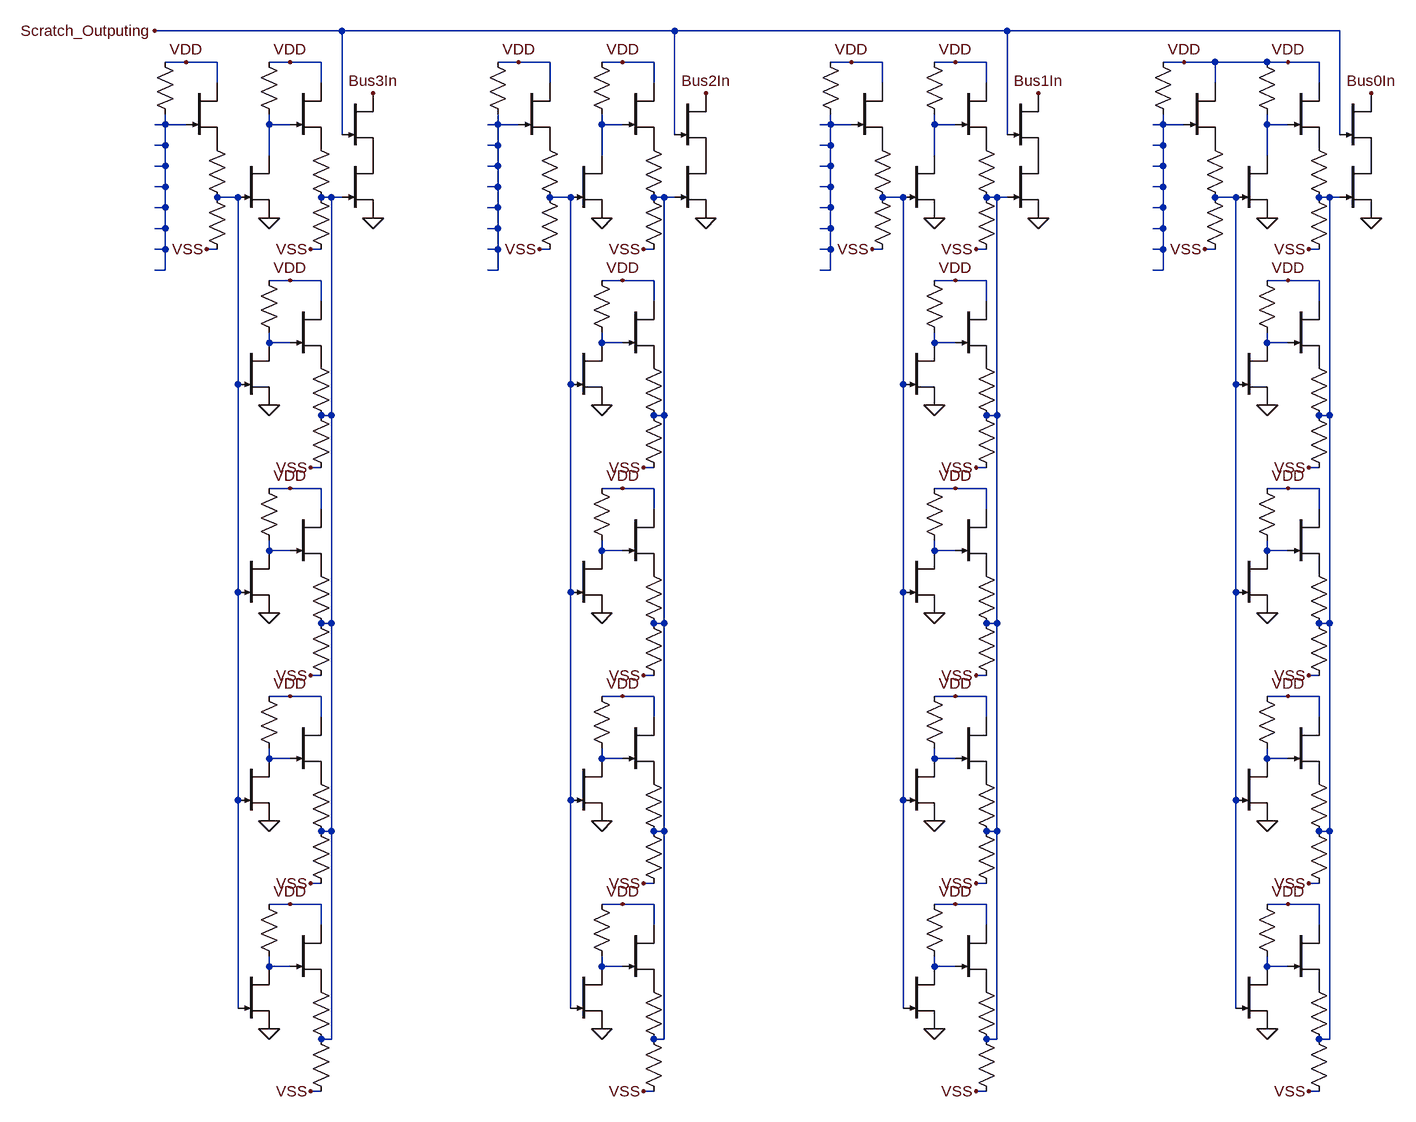
[diagram p0: schematic Bus2.asc]
Bus2.asc, the LTspice schematic file:
Version 4.1
SHEET 1 109444 42780
WIRE 40544 2832 40256 2832
WIRE 41056 2832 40544 2832
WIRE 41568 2832 41056 2832
WIRE 42080 2832 41568 2832
WIRE 40304 2880 40272 2880
WIRE 40352 2880 40304 2880
WIRE 40464 2880 40432 2880
WIRE 40512 2880 40464 2880
WIRE 40816 2880 40784 2880
WIRE 40864 2880 40816 2880
WIRE 40976 2880 40944 2880
WIRE 41024 2880 40976 2880
WIRE 41328 2880 41296 2880
WIRE 41376 2880 41328 2880
WIRE 41488 2880 41456 2880
WIRE 41536 2880 41488 2880
WIRE 41840 2880 41808 2880
WIRE 41888 2880 41840 2880
WIRE 41968 2880 41888 2880
WIRE 42000 2880 41968 2880
WIRE 42048 2880 42000 2880
WIRE 40352 2912 40352 2880
WIRE 40512 2912 40512 2880
WIRE 40864 2912 40864 2880
WIRE 41024 2912 41024 2880
WIRE 41376 2912 41376 2880
WIRE 41536 2912 41536 2880
WIRE 41888 2912 41888 2880
WIRE 42048 2912 42048 2880
WIRE 40272 2976 40272 2960
WIRE 40272 2976 40256 2976
WIRE 40304 2976 40272 2976
WIRE 40432 2976 40432 2960
WIRE 40464 2976 40432 2976
WIRE 40784 2976 40784 2960
WIRE 40784 2976 40768 2976
WIRE 40816 2976 40784 2976
WIRE 40944 2976 40944 2960
WIRE 40976 2976 40944 2976
WIRE 41296 2976 41296 2960
WIRE 41296 2976 41280 2976
WIRE 41328 2976 41296 2976
WIRE 41456 2976 41456 2960
WIRE 41488 2976 41456 2976
WIRE 41808 2976 41808 2960
WIRE 41808 2976 41792 2976
WIRE 41840 2976 41808 2976
WIRE 41968 2976 41968 2960
WIRE 42000 2976 41968 2976
WIRE 40544 2992 40544 2832
WIRE 41056 2992 41056 2832
WIRE 41568 2992 41568 2832
WIRE 42080 2992 42080 2832
WIRE 40272 3008 40272 2976
WIRE 40272 3008 40256 3008
WIRE 40784 3008 40784 2976
WIRE 40784 3008 40768 3008
WIRE 41296 3008 41296 2976
WIRE 41296 3008 41280 3008
WIRE 41808 3008 41808 2976
WIRE 41808 3008 41792 3008
WIRE 40432 3024 40432 2976
WIRE 40944 3024 40944 2976
WIRE 41456 3024 41456 2976
WIRE 41968 3024 41968 2976
WIRE 40272 3040 40272 3008
WIRE 40272 3040 40256 3040
WIRE 40784 3040 40784 3008
WIRE 40784 3040 40768 3040
WIRE 41296 3040 41296 3008
WIRE 41296 3040 41280 3040
WIRE 41808 3040 41808 3008
WIRE 41808 3040 41792 3040
WIRE 40272 3072 40272 3040
WIRE 40272 3072 40256 3072
WIRE 40784 3072 40784 3040
WIRE 40784 3072 40768 3072
WIRE 41296 3072 41296 3040
WIRE 41296 3072 41280 3072
WIRE 41808 3072 41808 3040
WIRE 41808 3072 41792 3072
WIRE 40384 3088 40352 3088
WIRE 40528 3088 40512 3088
WIRE 40544 3088 40528 3088
WIRE 40896 3088 40864 3088
WIRE 41040 3088 41024 3088
WIRE 41056 3088 41040 3088
WIRE 41408 3088 41376 3088
WIRE 41552 3088 41536 3088
WIRE 41568 3088 41552 3088
WIRE 41920 3088 41888 3088
WIRE 42064 3088 42048 3088
WIRE 42080 3088 42064 3088
WIRE 40272 3104 40272 3072
WIRE 40272 3104 40256 3104
WIRE 40784 3104 40784 3072
WIRE 40784 3104 40768 3104
WIRE 41296 3104 41296 3072
WIRE 41296 3104 41280 3104
WIRE 41808 3104 41808 3072
WIRE 41808 3104 41792 3104
WIRE 40272 3136 40272 3104
WIRE 40272 3136 40256 3136
WIRE 40784 3136 40784 3104
WIRE 40784 3136 40768 3136
WIRE 41296 3136 41296 3104
WIRE 41296 3136 41280 3136
WIRE 41808 3136 41808 3104
WIRE 41808 3136 41792 3136
WIRE 40272 3168 40272 3136
WIRE 40272 3168 40256 3168
WIRE 40352 3168 40336 3168
WIRE 40512 3168 40496 3168
WIRE 40784 3168 40784 3136
WIRE 40784 3168 40768 3168
WIRE 40864 3168 40848 3168
WIRE 41024 3168 41008 3168
WIRE 41296 3168 41296 3136
WIRE 41296 3168 41280 3168
WIRE 41376 3168 41360 3168
WIRE 41536 3168 41520 3168
WIRE 41808 3168 41808 3136
WIRE 41808 3168 41792 3168
WIRE 41888 3168 41872 3168
WIRE 42048 3168 42032 3168
WIRE 40272 3200 40272 3168
WIRE 40272 3200 40256 3200
WIRE 40784 3200 40784 3168
WIRE 40784 3200 40768 3200
WIRE 41296 3200 41296 3168
WIRE 41296 3200 41280 3200
WIRE 41808 3200 41808 3168
WIRE 41808 3200 41792 3200
WIRE 40464 3216 40432 3216
WIRE 40512 3216 40464 3216
WIRE 40976 3216 40944 3216
WIRE 41024 3216 40976 3216
WIRE 41488 3216 41456 3216
WIRE 41536 3216 41488 3216
WIRE 42000 3216 41968 3216
WIRE 42048 3216 42000 3216
WIRE 40512 3248 40512 3216
WIRE 41024 3248 41024 3216
WIRE 41536 3248 41536 3216
WIRE 42048 3248 42048 3216
WIRE 40432 3312 40432 3296
WIRE 40464 3312 40432 3312
WIRE 40944 3312 40944 3296
WIRE 40976 3312 40944 3312
WIRE 41456 3312 41456 3296
WIRE 41488 3312 41456 3312
WIRE 41968 3312 41968 3296
WIRE 42000 3312 41968 3312
WIRE 40384 3376 40384 3088
WIRE 40896 3376 40896 3088
WIRE 41408 3376 41408 3088
WIRE 41920 3376 41920 3088
WIRE 40528 3424 40528 3088
WIRE 40528 3424 40512 3424
WIRE 41040 3424 41040 3088
WIRE 41040 3424 41024 3424
WIRE 41552 3424 41552 3088
WIRE 41552 3424 41536 3424
WIRE 42064 3424 42064 3088
WIRE 42064 3424 42048 3424
WIRE 40512 3504 40496 3504
WIRE 41024 3504 41008 3504
WIRE 41536 3504 41520 3504
WIRE 42048 3504 42032 3504
WIRE 40464 3536 40432 3536
WIRE 40512 3536 40464 3536
WIRE 40976 3536 40944 3536
WIRE 41024 3536 40976 3536
WIRE 41488 3536 41456 3536
WIRE 41536 3536 41488 3536
WIRE 42000 3536 41968 3536
WIRE 42048 3536 42000 3536
WIRE 40512 3568 40512 3536
WIRE 41024 3568 41024 3536
WIRE 41536 3568 41536 3536
WIRE 42048 3568 42048 3536
WIRE 40432 3632 40432 3616
WIRE 40464 3632 40432 3632
WIRE 40944 3632 40944 3616
WIRE 40976 3632 40944 3632
WIRE 41456 3632 41456 3616
WIRE 41488 3632 41456 3632
WIRE 41968 3632 41968 3616
WIRE 42000 3632 41968 3632
WIRE 40384 3696 40384 3376
WIRE 40896 3696 40896 3376
WIRE 41408 3696 41408 3376
WIRE 41920 3696 41920 3376
WIRE 40528 3744 40528 3424
WIRE 40528 3744 40512 3744
WIRE 41040 3744 41040 3424
WIRE 41040 3744 41024 3744
WIRE 41552 3744 41552 3424
WIRE 41552 3744 41536 3744
WIRE 42064 3744 42064 3424
WIRE 42064 3744 42048 3744
WIRE 40512 3824 40496 3824
WIRE 41024 3824 41008 3824
WIRE 41536 3824 41520 3824
WIRE 42048 3824 42032 3824
WIRE 40464 3856 40432 3856
WIRE 40512 3856 40464 3856
WIRE 40976 3856 40944 3856
WIRE 41024 3856 40976 3856
WIRE 41488 3856 41456 3856
WIRE 41536 3856 41488 3856
WIRE 42000 3856 41968 3856
WIRE 42048 3856 42000 3856
WIRE 40512 3888 40512 3856
WIRE 41024 3888 41024 3856
WIRE 41536 3888 41536 3856
WIRE 42048 3888 42048 3856
WIRE 40432 3952 40432 3936
WIRE 40464 3952 40432 3952
WIRE 40944 3952 40944 3936
WIRE 40976 3952 40944 3952
WIRE 41456 3952 41456 3936
WIRE 41488 3952 41456 3952
WIRE 41968 3952 41968 3936
WIRE 42000 3952 41968 3952
WIRE 40384 4016 40384 3696
WIRE 40896 4016 40896 3696
WIRE 41408 4016 41408 3696
WIRE 41920 4016 41920 3696
WIRE 40528 4064 40528 3744
WIRE 40528 4064 40512 4064
WIRE 41040 4064 41040 3744
WIRE 41040 4064 41024 4064
WIRE 41552 4064 41552 3744
WIRE 41552 4064 41536 4064
WIRE 42064 4064 42064 3744
WIRE 42064 4064 42048 4064
WIRE 40512 4144 40496 4144
WIRE 41024 4144 41008 4144
WIRE 41536 4144 41520 4144
WIRE 42048 4144 42032 4144
WIRE 40464 4176 40432 4176
WIRE 40512 4176 40464 4176
WIRE 40976 4176 40944 4176
WIRE 41024 4176 40976 4176
WIRE 41488 4176 41456 4176
WIRE 41536 4176 41488 4176
WIRE 42000 4176 41968 4176
WIRE 42048 4176 42000 4176
WIRE 40512 4208 40512 4176
WIRE 41024 4208 41024 4176
WIRE 41536 4208 41536 4176
WIRE 42048 4208 42048 4176
WIRE 40432 4272 40432 4256
WIRE 40464 4272 40432 4272
WIRE 40944 4272 40944 4256
WIRE 40976 4272 40944 4272
WIRE 41456 4272 41456 4256
WIRE 41488 4272 41456 4272
WIRE 41968 4272 41968 4256
WIRE 42000 4272 41968 4272
WIRE 40384 4336 40384 4016
WIRE 40896 4336 40896 4016
WIRE 41408 4336 41408 4016
WIRE 41920 4336 41920 4016
WIRE 40528 4384 40528 4064
WIRE 40528 4384 40512 4384
WIRE 41040 4384 41040 4064
WIRE 41040 4384 41024 4384
WIRE 41552 4384 41552 4064
WIRE 41552 4384 41536 4384
WIRE 42064 4384 42064 4064
WIRE 42064 4384 42048 4384
WIRE 40512 4464 40496 4464
WIRE 41024 4464 41008 4464
WIRE 41536 4464 41520 4464
WIRE 42048 4464 42032 4464
FLAG 40256 2832 Scratch_Outputing
FLAG 40304 2880 VDD
FLAG 40464 2880 VDD
FLAG 40336 3168 VSS
FLAG 40496 3168 VSS
FLAG 40432 3120 0
FLAG 40592 3120 0
FLAG 40816 2880 VDD
FLAG 40976 2880 VDD
FLAG 40848 3168 VSS
FLAG 41008 3168 VSS
FLAG 40944 3120 0
FLAG 41104 3120 0
FLAG 41328 2880 VDD
FLAG 41488 2880 VDD
FLAG 41360 3168 VSS
FLAG 41520 3168 VSS
FLAG 41456 3120 0
FLAG 41616 3120 0
FLAG 41840 2880 VDD
FLAG 42000 2880 VDD
FLAG 41872 3168 VSS
FLAG 42032 3168 VSS
FLAG 41968 3120 0
FLAG 42128 3120 0
FLAG 40592 2928 Bus3In
FLAG 41104 2928 Bus2In
FLAG 41616 2928 Bus1In
FLAG 42128 2928 Bus0In
FLAG 40464 3216 VDD
FLAG 40496 3504 VSS
FLAG 40432 3408 0
FLAG 40464 3536 VDD
FLAG 40496 3824 VSS
FLAG 40432 3728 0
FLAG 40464 3856 VDD
FLAG 40496 4144 VSS
FLAG 40432 4048 0
FLAG 40464 4176 VDD
FLAG 40496 4464 VSS
FLAG 40432 4368 0
FLAG 40976 3216 VDD
FLAG 41008 3504 VSS
FLAG 40944 3408 0
FLAG 40976 3536 VDD
FLAG 41008 3824 VSS
FLAG 40944 3728 0
FLAG 40976 3856 VDD
FLAG 41008 4144 VSS
FLAG 40944 4048 0
FLAG 40976 4176 VDD
FLAG 41008 4464 VSS
FLAG 40944 4368 0
FLAG 41488 3216 VDD
FLAG 41520 3504 VSS
FLAG 41456 3408 0
FLAG 41488 3536 VDD
FLAG 41520 3824 VSS
FLAG 41456 3728 0
FLAG 41488 3856 VDD
FLAG 41520 4144 VSS
FLAG 41456 4048 0
FLAG 41488 4176 VDD
FLAG 41520 4464 VSS
FLAG 41456 4368 0
FLAG 42000 3216 VDD
FLAG 42032 3504 VSS
FLAG 41968 3408 0
FLAG 42000 3536 VDD
FLAG 42032 3824 VSS
FLAG 41968 3728 0
FLAG 42000 3856 VDD
FLAG 42032 4144 VSS
FLAG 41968 4048 0
FLAG 42000 4176 VDD
FLAG 42032 4464 VSS
FLAG 41968 4368 0
SYMBOL res 40256 2864 R0
WINDOW 0 -99 60 Invisible 2
WINDOW 3 -73 68 Invisible 2
SYMATTR InstName R0
SYMATTR Value 100k
SYMBOL njf 40304 2912 R0
WINDOW 0 -152 12 Invisible 2
WINDOW 3 -106 23 Invisible 2
SYMATTR InstName J0
SYMATTR Value DR
SYMBOL res 40336 2992 R0
WINDOW 0 -139 -67 Invisible 2
WINDOW 3 -141 -74 Invisible 2
SYMATTR InstName R1
SYMATTR Value 1k
SYMBOL res 40336 3072 R0
WINDOW 0 -145 -159 Invisible 2
WINDOW 3 -159 -144 Invisible 2
SYMATTR InstName R2
SYMATTR Value 4.8k
SYMBOL njf 40384 3024 R0
WINDOW 0 -215 -110 Invisible 2
WINDOW 3 -183 -109 Invisible 2
SYMATTR InstName J1
SYMATTR Value DR
SYMBOL res 40416 2864 R0
WINDOW 0 -241 69 Invisible 2
WINDOW 3 -237 55 Invisible 2
SYMATTR InstName R3
SYMATTR Value 50k
SYMBOL njf 40464 2912 R0
WINDOW 0 -299 7 Invisible 2
WINDOW 3 -270 17 Invisible 2
SYMATTR InstName J2
SYMATTR Value DR
SYMBOL res 40496 2992 R0
WINDOW 0 -308 -67 Invisible 2
WINDOW 3 -292 -72 Invisible 2
SYMATTR InstName R4
SYMATTR Value 1k
SYMBOL res 40528 3184 R180
WINDOW 0 312 268 Invisible 2
WINDOW 3 276 264 Invisible 2
SYMATTR InstName R5
SYMATTR Value 4.5k
SYMBOL njf 40544 3024 R0
WINDOW 0 -376 -108 Invisible 2
WINDOW 3 -338 -116 Invisible 2
SYMATTR InstName J3
SYMATTR Value DR
SYMBOL res 40768 2864 R0
WINDOW 0 -84 62 Invisible 2
WINDOW 3 -73 68 Invisible 2
SYMATTR InstName R6
SYMATTR Value 100k
SYMBOL njf 40816 2912 R0
WINDOW 0 -149 8 Invisible 2
WINDOW 3 -106 23 Invisible 2
SYMATTR InstName J4
SYMATTR Value DR
SYMBOL res 40848 2992 R0
WINDOW 0 -139 -67 Invisible 2
WINDOW 3 -141 -74 Invisible 2
SYMATTR InstName R7
SYMATTR Value 1k
SYMBOL res 40848 3072 R0
WINDOW 0 -167 -159 Invisible 2
WINDOW 3 -159 -144 Invisible 2
SYMATTR InstName R8
SYMATTR Value 4.8k
SYMBOL njf 40896 3024 R0
WINDOW 0 -215 -110 Invisible 2
WINDOW 3 -183 -109 Invisible 2
SYMATTR InstName J5
SYMATTR Value DR
SYMBOL res 40928 2864 R0
WINDOW 0 -241 69 Invisible 2
WINDOW 3 -237 55 Invisible 2
SYMATTR InstName R9
SYMATTR Value 50k
SYMBOL njf 40976 2912 R0
WINDOW 0 -320 5 Invisible 2
WINDOW 3 -270 17 Invisible 2
SYMATTR InstName J6
SYMATTR Value DR
SYMBOL res 41008 2992 R0
WINDOW 0 -296 -63 Invisible 2
WINDOW 3 -292 -72 Invisible 2
SYMATTR InstName R10
SYMATTR Value 1k
SYMBOL res 41040 3184 R180
WINDOW 0 312 268 Invisible 2
WINDOW 3 276 264 Invisible 2
SYMATTR InstName R11
SYMATTR Value 4.5k
SYMBOL njf 41056 3024 R0
WINDOW 0 -383 -108 Invisible 2
WINDOW 3 -338 -116 Invisible 2
SYMATTR InstName J7
SYMATTR Value DR
SYMBOL res 41280 2864 R0
WINDOW 0 -85 50 Invisible 2
WINDOW 3 -73 68 Invisible 2
SYMATTR InstName R12
SYMATTR Value 100k
SYMBOL njf 41328 2912 R0
WINDOW 0 -174 8 Invisible 2
WINDOW 3 -106 23 Invisible 2
SYMATTR InstName J8
SYMATTR Value DR
SYMBOL res 41360 2992 R0
WINDOW 0 -177 -72 Invisible 2
WINDOW 3 -141 -74 Invisible 2
SYMATTR InstName R13
SYMATTR Value 1k
SYMBOL res 41360 3072 R0
WINDOW 0 -154 -159 Invisible 2
WINDOW 3 -159 -144 Invisible 2
SYMATTR InstName R14
SYMATTR Value 4.8k
SYMBOL njf 41408 3024 R0
WINDOW 0 -215 -110 Invisible 2
WINDOW 3 -183 -109 Invisible 2
SYMATTR InstName J9
SYMATTR Value DR
SYMBOL res 41440 2864 R0
WINDOW 0 -241 69 Invisible 2
WINDOW 3 -237 55 Invisible 2
SYMATTR InstName R15
SYMATTR Value 50k
SYMBOL njf 41488 2912 R0
WINDOW 0 -316 6 Invisible 2
WINDOW 3 -270 17 Invisible 2
SYMATTR InstName J10
SYMATTR Value DR
SYMBOL res 41520 2992 R0
WINDOW 0 -296 -63 Invisible 2
WINDOW 3 -292 -72 Invisible 2
SYMATTR InstName R16
SYMATTR Value 1k
SYMBOL res 41552 3184 R180
WINDOW 0 312 268 Invisible 2
WINDOW 3 276 264 Invisible 2
SYMATTR InstName R17
SYMATTR Value 4.5k
SYMBOL njf 41568 3024 R0
WINDOW 0 -387 -109 Invisible 2
WINDOW 3 -338 -116 Invisible 2
SYMATTR InstName J11
SYMATTR Value DR
SYMBOL res 41792 2864 R0
WINDOW 0 -87 58 Invisible 2
WINDOW 3 -73 68 Invisible 2
SYMATTR InstName R18
SYMATTR Value 100k
SYMBOL njf 41840 2912 R0
WINDOW 0 -162 4 Invisible 2
WINDOW 3 -106 23 Invisible 2
SYMATTR InstName J12
SYMATTR Value DR
SYMBOL res 41872 2992 R0
WINDOW 0 -139 -67 Invisible 2
WINDOW 3 -141 -74 Invisible 2
SYMATTR InstName R19
SYMATTR Value 1k
SYMBOL res 41872 3072 R0
WINDOW 0 -158 -160 Invisible 2
WINDOW 3 -159 -144 Invisible 2
SYMATTR InstName R20
SYMATTR Value 4.8k
SYMBOL njf 41920 3024 R0
WINDOW 0 -215 -110 Invisible 2
WINDOW 3 -183 -109 Invisible 2
SYMATTR InstName J13
SYMATTR Value DR
SYMBOL res 41952 2864 R0
WINDOW 0 -241 69 Invisible 2
WINDOW 3 -237 55 Invisible 2
SYMATTR InstName R21
SYMATTR Value 50k
SYMBOL njf 42000 2912 R0
WINDOW 0 -304 6 Invisible 2
WINDOW 3 -270 17 Invisible 2
SYMATTR InstName J14
SYMATTR Value DR
SYMBOL res 42032 2992 R0
WINDOW 0 -296 -63 Invisible 2
WINDOW 3 -292 -72 Invisible 2
SYMATTR InstName R22
SYMATTR Value 1k
SYMBOL res 42064 3184 R180
WINDOW 0 312 268 Invisible 2
WINDOW 3 276 264 Invisible 2
SYMATTR InstName R23
SYMATTR Value 4.5k
SYMBOL njf 42080 3024 R0
WINDOW 0 -396 -111 Invisible 2
WINDOW 3 -338 -116 Invisible 2
SYMATTR InstName J15
SYMATTR Value DR
SYMBOL njf 40544 2928 R0
WINDOW 0 -382 0 Invisible 2
WINDOW 3 -360 4 Invisible 2
SYMATTR InstName J16
SYMATTR Value DR
SYMBOL njf 41056 2928 R0
WINDOW 0 -369 1 Invisible 2
WINDOW 3 -338 -46 Invisible 2
SYMATTR InstName J17
SYMATTR Value DR
SYMBOL njf 41568 2928 R0
WINDOW 0 -370 7 Invisible 2
WINDOW 3 -345 -18 Invisible 2
SYMATTR InstName J18
SYMATTR Value DR
SYMBOL njf 42080 2928 R0
WINDOW 0 -385 5 Invisible 2
WINDOW 3 -354 -20 Invisible 2
SYMATTR InstName J19
SYMATTR Value DR
SYMBOL njf 40384 3312 R0
WINDOW 0 -340 -64 Invisible 2
WINDOW 3 -315 -65 Invisible 2
SYMATTR InstName J20
SYMATTR Value DR
SYMBOL res 40416 3200 R0
WINDOW 0 -334 52 Invisible 2
WINDOW 3 -328 50 Invisible 2
SYMATTR InstName R24
SYMATTR Value 50k
SYMBOL njf 40464 3248 R0
WINDOW 0 -407 -3 Invisible 2
WINDOW 3 -379 6 Invisible 2
SYMATTR InstName J21
SYMATTR Value DR
SYMBOL res 40496 3328 R0
WINDOW 0 -432 -83 Invisible 2
WINDOW 3 -426 -96 Invisible 2
SYMATTR InstName R25
SYMATTR Value 1k
SYMBOL res 40528 3520 R180
WINDOW 0 408 274 Invisible 2
WINDOW 3 436 271 Invisible 2
SYMATTR InstName R26
SYMATTR Value 4.5k
SYMBOL njf 40384 3632 R0
WINDOW 0 -340 -64 Invisible 2
WINDOW 3 -315 -65 Invisible 2
SYMATTR InstName J22
SYMATTR Value DR
SYMBOL res 40416 3520 R0
WINDOW 0 -334 52 Invisible 2
WINDOW 3 -328 50 Invisible 2
SYMATTR InstName R27
SYMATTR Value 50k
SYMBOL njf 40464 3568 R0
WINDOW 0 -407 -3 Invisible 2
WINDOW 3 -379 6 Invisible 2
SYMATTR InstName J23
SYMATTR Value DR
SYMBOL res 40496 3648 R0
WINDOW 0 -432 -83 Invisible 2
WINDOW 3 -426 -96 Invisible 2
SYMATTR InstName R28
SYMATTR Value 1k
SYMBOL res 40528 3840 R180
WINDOW 0 408 274 Invisible 2
WINDOW 3 436 271 Invisible 2
SYMATTR InstName R29
SYMATTR Value 4.5k
SYMBOL njf 40384 3952 R0
WINDOW 0 -340 -64 Invisible 2
WINDOW 3 -315 -65 Invisible 2
SYMATTR InstName J24
SYMATTR Value DR
SYMBOL res 40416 3840 R0
WINDOW 0 -334 52 Invisible 2
WINDOW 3 -328 50 Invisible 2
SYMATTR InstName R30
SYMATTR Value 50k
SYMBOL njf 40464 3888 R0
WINDOW 0 -407 -3 Invisible 2
WINDOW 3 -379 6 Invisible 2
SYMATTR InstName J25
SYMATTR Value DR
SYMBOL res 40496 3968 R0
WINDOW 0 -432 -83 Invisible 2
WINDOW 3 -426 -96 Invisible 2
SYMATTR InstName R31
SYMATTR Value 1k
SYMBOL res 40528 4160 R180
WINDOW 0 408 274 Invisible 2
WINDOW 3 436 271 Invisible 2
SYMATTR InstName R32
SYMATTR Value 4.5k
SYMBOL njf 40384 4272 R0
WINDOW 0 -340 -64 Invisible 2
WINDOW 3 -315 -65 Invisible 2
SYMATTR InstName J26
SYMATTR Value DR
SYMBOL res 40416 4160 R0
WINDOW 0 -334 52 Invisible 2
WINDOW 3 -328 50 Invisible 2
SYMATTR InstName R33
SYMATTR Value 50k
SYMBOL njf 40464 4208 R0
WINDOW 0 -407 -3 Invisible 2
WINDOW 3 -379 6 Invisible 2
SYMATTR InstName J27
SYMATTR Value DR
SYMBOL res 40496 4288 R0
WINDOW 0 -432 -83 Invisible 2
WINDOW 3 -426 -96 Invisible 2
SYMATTR InstName R34
SYMATTR Value 1k
SYMBOL res 40528 4480 R180
WINDOW 0 408 274 Invisible 2
WINDOW 3 436 271 Invisible 2
SYMATTR InstName R35
SYMATTR Value 4.5k
SYMBOL njf 40896 3312 R0
WINDOW 0 -340 -64 Invisible 2
WINDOW 3 -315 -65 Invisible 2
SYMATTR InstName J28
SYMATTR Value DR
SYMBOL res 40928 3200 R0
WINDOW 0 -334 52 Invisible 2
WINDOW 3 -328 50 Invisible 2
SYMATTR InstName R36
SYMATTR Value 50k
SYMBOL njf 40976 3248 R0
WINDOW 0 -407 -3 Invisible 2
WINDOW 3 -379 6 Invisible 2
SYMATTR InstName J29
SYMATTR Value DR
SYMBOL res 41008 3328 R0
WINDOW 0 -432 -83 Invisible 2
WINDOW 3 -426 -96 Invisible 2
SYMATTR InstName R37
SYMATTR Value 1k
SYMBOL res 41040 3520 R180
WINDOW 0 408 274 Invisible 2
WINDOW 3 436 271 Invisible 2
SYMATTR InstName R38
SYMATTR Value 4.5k
SYMBOL njf 40896 3632 R0
WINDOW 0 -340 -64 Invisible 2
WINDOW 3 -315 -65 Invisible 2
SYMATTR InstName J30
SYMATTR Value DR
SYMBOL res 40928 3520 R0
WINDOW 0 -334 52 Invisible 2
WINDOW 3 -328 50 Invisible 2
SYMATTR InstName R39
SYMATTR Value 50k
SYMBOL njf 40976 3568 R0
WINDOW 0 -407 -3 Invisible 2
WINDOW 3 -379 6 Invisible 2
SYMATTR InstName J31
SYMATTR Value DR
SYMBOL res 41008 3648 R0
WINDOW 0 -432 -83 Invisible 2
WINDOW 3 -426 -96 Invisible 2
SYMATTR InstName R40
SYMATTR Value 1k
SYMBOL res 41040 3840 R180
WINDOW 0 408 274 Invisible 2
WINDOW 3 436 271 Invisible 2
SYMATTR InstName R41
SYMATTR Value 4.5k
SYMBOL njf 40896 3952 R0
WINDOW 0 -340 -64 Invisible 2
WINDOW 3 -315 -65 Invisible 2
SYMATTR InstName J32
SYMATTR Value DR
SYMBOL res 40928 3840 R0
WINDOW 0 -334 52 Invisible 2
WINDOW 3 -328 50 Invisible 2
SYMATTR InstName R42
SYMATTR Value 50k
SYMBOL njf 40976 3888 R0
WINDOW 0 -407 -3 Invisible 2
WINDOW 3 -379 6 Invisible 2
SYMATTR InstName J33
SYMATTR Value DR
SYMBOL res 41008 3968 R0
WINDOW 0 -432 -83 Invisible 2
WINDOW 3 -426 -96 Invisible 2
SYMATTR InstName R43
SYMATTR Value 1k
SYMBOL res 41040 4160 R180
WINDOW 0 408 274 Invisible 2
WINDOW 3 436 271 Invisible 2
SYMATTR InstName R44
SYMATTR Value 4.5k
SYMBOL njf 40896 4272 R0
WINDOW 0 -340 -64 Invisible 2
WINDOW 3 -315 -65 Invisible 2
SYMATTR InstName J34
SYMATTR Value DR
SYMBOL res 40928 4160 R0
WINDOW 0 -334 52 Invisible 2
WINDOW 3 -328 50 Invisible 2
SYMATTR InstName R45
SYMATTR Value 50k
SYMBOL njf 40976 4208 R0
WINDOW 0 -407 -3 Invisible 2
WINDOW 3 -379 6 Invisible 2
SYMATTR InstName J35
SYMATTR Value DR
SYMBOL res 41008 4288 R0
WINDOW 0 -432 -83 Invisible 2
WINDOW 3 -426 -96 Invisible 2
SYMATTR InstName R46
SYMATTR Value 1k
SYMBOL res 41040 4480 R180
WINDOW 0 408 274 Invisible 2
WINDOW 3 436 271 Invisible 2
SYMATTR InstName R47
SYMATTR Value 4.5k
SYMBOL njf 41408 3312 R0
WINDOW 0 -340 -64 Invisible 2
WINDOW 3 -315 -65 Invisible 2
SYMATTR InstName J36
SYMATTR Value DR
SYMBOL res 41440 3200 R0
WINDOW 0 -334 52 Invisible 2
WINDOW 3 -328 50 Invisible 2
SYMATTR InstName R48
SYMATTR Value 50k
SYMBOL njf 41488 3248 R0
WINDOW 0 -407 -3 Invisible 2
WINDOW 3 -379 6 Invisible 2
SYMATTR InstName J37
SYMATTR Value DR
SYMBOL res 41520 3328 R0
WINDOW 0 -432 -83 Invisible 2
WINDOW 3 -426 -96 Invisible 2
SYMATTR InstName R49
SYMATTR Value 1k
SYMBOL res 41552 3520 R180
WINDOW 0 408 274 Invisible 2
WINDOW 3 436 271 Invisible 2
SYMATTR InstName R50
SYMATTR Value 4.5k
SYMBOL njf 41408 3632 R0
WINDOW 0 -340 -64 Invisible 2
WINDOW 3 -315 -65 Invisible 2
SYMATTR InstName J38
SYMATTR Value DR
SYMBOL res 41440 3520 R0
WINDOW 0 -334 52 Invisible 2
WINDOW 3 -328 50 Invisible 2
SYMATTR InstName R51
SYMATTR Value 50k
SYMBOL njf 41488 3568 R0
WINDOW 0 -407 -3 Invisible 2
WINDOW 3 -379 6 Invisible 2
SYMATTR InstName J39
SYMATTR Value DR
SYMBOL res 41520 3648 R0
WINDOW 0 -432 -83 Invisible 2
WINDOW 3 -426 -96 Invisible 2
SYMATTR InstName R52
SYMATTR Value 1k
SYMBOL res 41552 3840 R180
WINDOW 0 408 274 Invisible 2
WINDOW 3 436 271 Invisible 2
SYMATTR InstName R53
SYMATTR Value 4.5k
SYMBOL njf 41408 3952 R0
WINDOW 0 -340 -64 Invisible 2
WINDOW 3 -315 -65 Invisible 2
SYMATTR InstName J40
SYMATTR Value DR
SYMBOL res 41440 3840 R0
WINDOW 0 -334 52 Invisible 2
WINDOW 3 -328 50 Invisible 2
SYMATTR InstName R54
SYMATTR Value 50k
SYMBOL njf 41488 3888 R0
WINDOW 0 -407 -3 Invisible 2
WINDOW 3 -379 6 Invisible 2
SYMATTR InstName J41
SYMATTR Value DR
SYMBOL res 41520 3968 R0
WINDOW 0 -432 -83 Invisible 2
WINDOW 3 -426 -96 Invisible 2
SYMATTR InstName R55
SYMATTR Value 1k
SYMBOL res 41552 4160 R180
WINDOW 0 408 274 Invisible 2
WINDOW 3 436 271 Invisible 2
SYMATTR InstName R56
SYMATTR Value 4.5k
SYMBOL njf 41408 4272 R0
WINDOW 0 -340 -64 Invisible 2
WINDOW 3 -315 -65 Invisible 2
SYMATTR InstName J42
SYMATTR Value DR
SYMBOL res 41440 4160 R0
WINDOW 0 -334 52 Invisible 2
WINDOW 3 -328 50 Invisible 2
SYMATTR InstName R57
SYMATTR Value 50k
SYMBOL njf 41488 4208 R0
WINDOW 0 -407 -3 Invisible 2
WINDOW 3 -379 6 Invisible 2
SYMATTR InstName J43
SYMATTR Value DR
SYMBOL res 41520 4288 R0
WINDOW 0 -432 -83 Invisible 2
WINDOW 3 -426 -96 Invisible 2
SYMATTR InstName R58
SYMATTR Value 1k
SYMBOL res 41552 4480 R180
WINDOW 0 408 274 Invisible 2
WINDOW 3 436 271 Invisible 2
SYMATTR InstName R59
SYMATTR Value 4.5k
SYMBOL njf 41920 3312 R0
WINDOW 0 -340 -64 Invisible 2
WINDOW 3 -315 -65 Invisible 2
SYMATTR InstName J44
SYMATTR Value DR
SYMBOL res 41952 3200 R0
WINDOW 0 -334 52 Invisible 2
WINDOW 3 -328 50 Invisible 2
SYMATTR InstName R60
SYMATTR Value 50k
SYMBOL njf 42000 3248 R0
WINDOW 0 -407 -3 Invisible 2
WINDOW 3 -379 6 Invisible 2
SYMATTR InstName J45
SYMATTR Value DR
SYMBOL res 42032 3328 R0
WINDOW 0 -432 -83 Invisible 2
WINDOW 3 -426 -96 Invisible 2
SYMATTR InstName R61
SYMATTR Value 1k
SYMBOL res 42064 3520 R180
WINDOW 0 408 274 Invisible 2
WINDOW 3 436 271 Invisible 2
SYMATTR InstName R62
SYMATTR Value 4.5k
SYMBOL njf 41920 3632 R0
WINDOW 0 -340 -64 Invisible 2
WINDOW 3 -315 -65 Invisible 2
SYMATTR InstName J46
SYMATTR Value DR
SYMBOL res 41952 3520 R0
WINDOW 0 -334 52 Invisible 2
WINDOW 3 -328 50 Invisible 2
SYMATTR InstName R63
SYMATTR Value 50k
SYMBOL njf 42000 3568 R0
WINDOW 0 -407 -3 Invisible 2
WINDOW 3 -379 6 Invisible 2
SYMATTR InstName J47
SYMATTR Value DR
SYMBOL res 42032 3648 R0
WINDOW 0 -432 -83 Invisible 2
WINDOW 3 -426 -96 Invisible 2
SYMATTR InstName R64
SYMATTR Value 1k
SYMBOL res 42064 3840 R180
WINDOW 0 408 274 Invisible 2
WINDOW 3 436 271 Invisible 2
SYMATTR InstName R65
SYMATTR Value 4.5k
SYMBOL njf 41920 3952 R0
WINDOW 0 -340 -64 Invisible 2
WINDOW 3 -315 -65 Invisible 2
SYMATTR InstName J48
SYMATTR Value DR
SYMBOL res 41952 3840 R0
WINDOW 0 -334 52 Invisible 2
WINDOW 3 -328 50 Invisible 2
SYMATTR InstName R66
SYMATTR Value 50k
SYMBOL njf 42000 3888 R0
WINDOW 0 -407 -3 Invisible 2
WINDOW 3 -379 6 Invisible 2
SYMATTR InstName J49
SYMATTR Value DR
SYMBOL res 42032 3968 R0
WINDOW 0 -432 -83 Invisible 2
WINDOW 3 -426 -96 Invisible 2
SYMATTR InstName R67
SYMATTR Value 1k
SYMBOL res 42064 4160 R180
WINDOW 0 408 274 Invisible 2
WINDOW 3 436 271 Invisible 2
SYMATTR InstName R68
SYMATTR Value 4.5k
SYMBOL njf 41920 4272 R0
WINDOW 0 -340 -64 Invisible 2
WINDOW 3 -315 -65 Invisible 2
SYMATTR InstName J50
SYMATTR Value DR
SYMBOL res 41952 4160 R0
WINDOW 0 -334 52 Invisible 2
WINDOW 3 -328 50 Invisible 2
SYMATTR InstName R69
SYMATTR Value 50k
SYMBOL njf 42000 4208 R0
WINDOW 0 -407 -3 Invisible 2
WINDOW 3 -379 6 Invisible 2
SYMATTR InstName J51
SYMATTR Value DR
SYMBOL res 42032 4288 R0
WINDOW 0 -432 -83 Invisible 2
WINDOW 3 -426 -96 Invisible 2
SYMATTR InstName R70
SYMATTR Value 1k
SYMBOL res 42064 4480 R180
WINDOW 0 408 274 Invisible 2
WINDOW 3 436 271 Invisible 2
SYMATTR InstName R71
SYMATTR Value 4.5k

The netlist it stands for:
* Bus2.asc
R0 VDD N001 100k
J0 VDD N001 P001 DR
R1 P001 N009 1k
R2 N009 VSS 4.8k
J1 N002 N009 0 DR
R3 VDD N002 50k
J2 VDD N002 P002 DR
R4 P002 N010 1k
R5 VSS N010 4.5k
J3 P003 N010 0 DR
R6 VDD N003 100k
J4 VDD N003 P004 DR
R7 P004 N011 1k
R8 N011 VSS 4.8k
J5 N004 N011 0 DR
R9 VDD N004 50k
J6 VDD N004 P005 DR
R10 P005 N012 1k
R11 VSS N012 4.5k
J7 P006 N012 0 DR
R12 VDD N005 100k
J8 VDD N005 P007 DR
R13 P007 N013 1k
R14 N013 VSS 4.8k
J9 N006 N013 0 DR
R15 VDD N006 50k
J10 VDD N006 P008 DR
R16 P008 N014 1k
R17 VSS N014 4.5k
J11 P009 N014 0 DR
R18 VDD N007 100k
J12 VDD N007 P010 DR
R19 P010 N015 1k
R20 N015 VSS 4.8k
J13 N008 N015 0 DR
R21 VDD N008 50k
J14 VDD N008 P011 DR
R22 P011 N016 1k
R23 VSS N016 4.5k
J15 P012 N016 0 DR
J16 Bus3In Scratch_Outputing P003 DR
J17 Bus2In Scratch_Outputing P006 DR
J18 Bus1In Scratch_Outputing P009 DR
J19 Bus0In Scratch_Outputing P012 DR
J20 N017 N009 0 DR
R24 VDD N017 50k
J21 VDD N017 P013 DR
R25 P013 N010 1k
R26 VSS N010 4.5k
J22 N021 N009 0 DR
R27 VDD N021 50k
J23 VDD N021 P014 DR
R28 P014 N010 1k
R29 VSS N010 4.5k
J24 N025 N009 0 DR
R30 VDD N025 50k
J25 VDD N025 P015 DR
R31 P015 N010 1k
R32 VSS N010 4.5k
J26 N029 N009 0 DR
R33 VDD N029 50k
J27 VDD N029 P016 DR
R34 P016 N010 1k
R35 VSS N010 4.5k
J28 N018 N011 0 DR
R36 VDD N018 50k
J29 VDD N018 P017 DR
R37 P017 N012 1k
R38 VSS N012 4.5k
J30 N022 N011 0 DR
R39 VDD N022 50k
J31 VDD N022 P018 DR
R40 P018 N012 1k
R41 VSS N012 4.5k
J32 N026 N011 0 DR
R42 VDD N026 50k
J33 VDD N026 P019 DR
R43 P019 N012 1k
R44 VSS N012 4.5k
J34 N030 N011 0 DR
R45 VDD N030 50k
J35 VDD N030 P020 DR
R46 P020 N012 1k
R47 VSS N012 4.5k
J36 N019 N013 0 DR
R48 VDD N019 50k
J37 VDD N019 P021 DR
R49 P021 N014 1k
R50 VSS N014 4.5k
J38 N023 N013 0 DR
R51 VDD N023 50k
J39 VDD N023 P022 DR
R52 P022 N014 1k
R53 VSS N014 4.5k
J40 N027 N013 0 DR
R54 VDD N027 50k
J41 VDD N027 P023 DR
R55 P023 N014 1k
R56 VSS N014 4.5k
J42 N031 N013 0 DR
R57 VDD N031 50k
J43 VDD N031 P024 DR
R58 P024 N014 1k
R59 VSS N014 4.5k
J44 N020 N015 0 DR
R60 VDD N020 50k
J45 VDD N020 P025 DR
R61 P025 N016 1k
R62 VSS N016 4.5k
J46 N024 N015 0 DR
R63 VDD N024 50k
J47 VDD N024 P026 DR
R64 P026 N016 1k
R65 VSS N016 4.5k
J48 N028 N015 0 DR
R66 VDD N028 50k
J49 VDD N028 P027 DR
R67 P027 N016 1k
R68 VSS N016 4.5k
J50 N032 N015 0 DR
R69 VDD N032 50k
J51 VDD N032 P028 DR
R70 P028 N016 1k
R71 VSS N016 4.5k
.model NJF NJF
.model PJF PJF
.lib standard.jft
.backanno
.end